# Altium schematic sheet ToolDoorController.SchDoc: Tool Armoury Slave
size A4; DrawnBy: Luke Hovington; Organization: HSBNE; DocumentNumber: 1; Revision: 1.3; SheetNumber: 1; SheetTotal: 1; ProjectName: Tool Armoury Slave
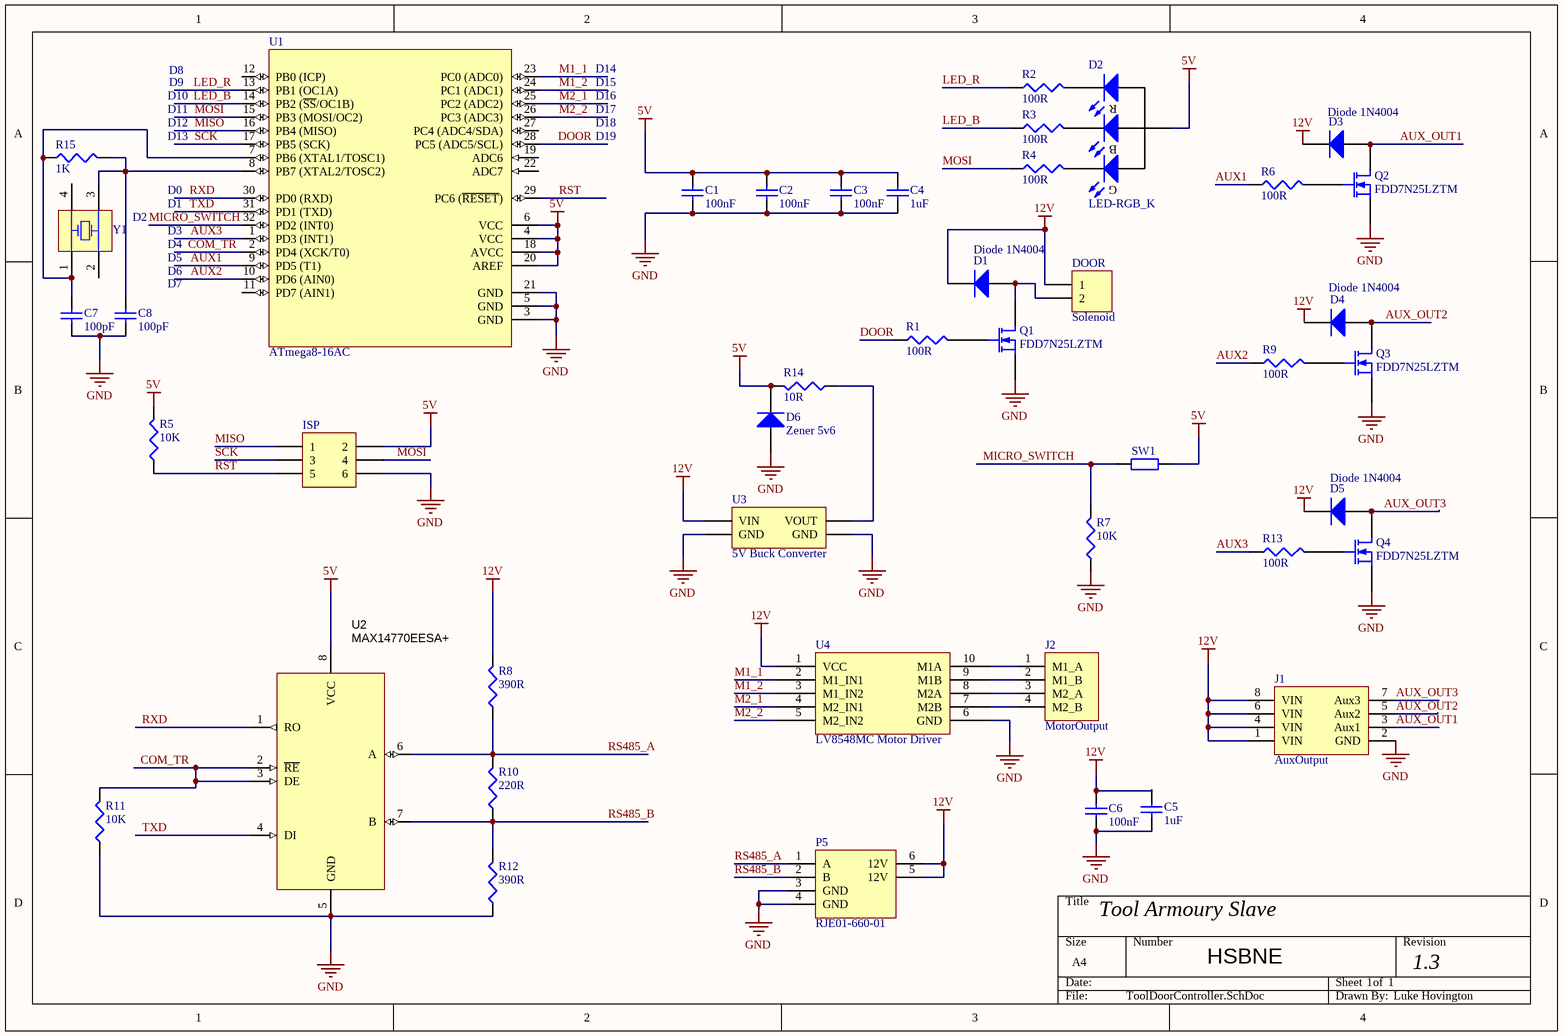
[diagram p0: ToolDoorController.SchDoc]

## Parts
C1  100nF  [C1206]
C2  100nF  [C1206]
C3  100nF  [C1206]
C4  1uF  [C1206]
C5  1uF  [C1206]
C6  100nF  [C1206]
C7  100pF  [C1206]
C8  100pF  [C1206]
D1  Diode 1N4004  [DO-41]
D2  LED-RGB_K  [RGB-CLVBAFKA]
D3  Diode 1N4004  [DO-41]  (no BOM)
D4  Diode 1N4004  [DO-41]  (no BOM)
D5  Diode 1N4004  [DO-41]  (no BOM)
D6  Zener 5v6  [DO-41]
DOOR  Solenoid  [JST-XH]
ISP  ISP  [HDR2X3]  (value not drawn)
J1  AuxOutput  [AUX-Out]
J2  MotorOutput  [Motor_Out]
P5  RJE01-660-01  [RJ11]
Q1  FDD7N25LZTM  [DPAC-3]
Q2  FDD7N25LZTM  [DPAC-3]  (no BOM)
Q3  FDD7N25LZTM  [DPAC-3]  (no BOM)
Q4  FDD7N25LZTM  [DPAC-3]  (no BOM)
R1  100R  [C1206]
R2  100R  [C1206]
R3  100R  [C1206]
R4  100R  [C1206]
R5  10K  [C1206]
R6  100R  [C1206]
R7  10K  [C1206]
R8  390R  [C1206]  (no BOM)
R9  100R  [C1206]
R10  220R  [C1206]  (no BOM)
R11  10K  [C1206]
R12  390R  [C1206]  (no BOM)
R13  100R  [C1206]
R14  10R  [C1206]
R15  1K  [C1206]
SW1  Switch  [ReedSwitch]  (value not drawn)
U1  ATmega8-16AC  [32A_N]
U2  MAX14770EESA+  [8S1_L]
U3  5V Buck Converter  [Buck_Module - upsidedown]
U4  LV8548MC Motor Driver  [10S1_M]
Y1  Crystal  [CRYSTAL_AXIAL]  (value not drawn)

## Nets
5V: C1.2 C2.2 C3.2 C4.2 D2.2(A) D6.2(K) ISP.2 R5.2 R14.2 SW1.2 U1.4(VCC) U1.6(VCC) U1.18(AVCC) U1.20(AREF) U2.8(VCC)
12V: C5.2 C6.2 D1.2(K) D3.2(K) D4.2(K) D5.2(K) DOOR.1 J1.1(VIN) J1.4(VIN) J1.6(VIN) J1.8(VIN) P5.5(12V) P5.6(12V) R8.2 U3.1(VIN) U4.1(VCC)
GND: C1.1 C2.1 C3.1 C4.1 C5.1 C6.1 C7.1 C8.1 D6.1(A) ISP.6 J1.2(GND) P5.3(GND) P5.4(GND) Q1.3(S) Q2.3(S) Q3.3(S) Q4.3(S) R7.1 R11.1 R12.1 U1.3(GND) U1.5(GND) U1.21(GND) U2.5(GND) U3.3(GND) U3.4(GND) U4.6(GND)
AUX1: R6.1 U1.9(PD5_(T1))
AUX2: R9.1 U1.10(PD6_(AIN0))
AUX3: R13.1 U1.1(PD3_(INT1))
AUX_OUT1: D3.1(A) J1.3(Aux1) Q2.1(D)
AUX_OUT2: D4.1(A) J1.5(Aux2) Q3.1(D)
AUX_OUT3: D5.1(A) J1.7(Aux3) Q4.1(D)
COM_TR: R11.2 U1.2(PD4_(XCK/T0)) U2.2(~{RE}) U2.3(DE)
DOOR: R1.1 U1.28(PC5_(ADC5/SCL))
LED_B: R3.1 U1.14(PB2_(~{SS}/OC1B))
LED_R: R2.1 U1.13(PB1_(OC1A))
M1_1: U1.23(PC0_(ADC0)) U4.2(M1_IN1)
M1_2: U1.24(PC1_(ADC1)) U4.3(M1_IN2)
M2_1: U1.25(PC2_(ADC2)) U4.4(M2_IN1)
M2_2: U1.26(PC3_(ADC3)) U4.5(M2_IN2)
MICRO_SWITCH: R7.2 SW1.1 U1.32(PD2_(INT0))
MISO: ISP.1 U1.16(PB4_(MISO))
MOSI: ISP.4 R4.1 U1.15(PB3_(MOSI/OC2))
RS485_A: P5.1(A) R8.1 R10.2 U2.6(A)
RS485_B: P5.2(B) R10.1 R12.2 U2.7(B)
RST: ISP.5 R5.1 U1.29(PC6_(~{RESET}))
RXD: U1.30(PD0_(RXD)) U2.1(RO)
SCK: ISP.3 U1.17(PB5_(SCK))
TXD: U1.31(PD1_(TXD)) U2.4(DI)
NetC7_2: C7.2 R15.1 U1.7(PB6_(XTAL1/TOSC1)) Y1.1(OSC1)
NetC8_2: C8.2 R15.2 U1.8(PB7_(XTAL2/TOSC2)) Y1.3(OSC2)
NetD1_1: D1.1(A) DOOR.2 Q1.1(D)
NetD2_1: D2.1(K-R) R2.2
NetD2_3: D2.3(K-B) R3.2
NetD2_4: D2.4(K-G) R4.2
NetJ2_1: J2.1(M1_A) U4.10(M1A)
NetJ2_2: J2.2(M1_B) U4.9(M1B)
NetJ2_3: J2.3(M2_A) U4.8(M2A)
NetJ2_4: J2.4(M2_B) U4.7(M2B)
NetQ1_2: Q1.2(G) R1.2
NetQ2_2: Q2.2(G) R6.2
NetQ3_2: Q3.2(G) R9.2
NetQ4_2: Q4.2(G) R13.2
NetR14_1: R14.1 U3.2(VOUT)

Not connected (* = marked no-connect by the designer): U1 11(PD7_(AIN1)) 12(PB0_(ICP)) 19(ADC6) 22(ADC7) 27(PC4_(ADC4/SDA)); Y1 2(OSC2) 4(OSC1)

## Notes on the sheet
- D10
- D11
- D8
- D9
- D14
- D15
- D16
- D17
- D12
- D13
- D18
- D19
- (near Y1) D2
- D0
- D1
- D3
- D4
- D5
- D6
- (near C8) D7
- (in symbol LED-RGB_K) R; B; G

## Library data of the parts
C1-C3 C6 = Cap 100nF: Capacitor (Semiconductor SIM Model); Published: 8-Jun-2000; LatestRevisionDate: 29-May-2009; LatestRevisionNote: IPC-7351 Footprint Added.; PackageReference: C1206; Publisher: Altium Limited; PackageDescription: Chip Capacitor; Value: 100nF; Supplier 1: Digi-Key; Supplier 2: Mouser; Supplier Part Number 1: 399-1249-1-ND; Supplier Part Number 2: 80-C1206C104K5R
C4 C5 = Cap 1uF: Capacitor (Semiconductor SIM Model); Published: 8-Jun-2000; LatestRevisionDate: 29-May-2009; LatestRevisionNote: IPC-7351 Footprint Added.; PackageReference: C1206; Publisher: Altium Limited; PackageDescription: Chip Capacitor; Value: 1uF; Supplier 1: Mouser; Supplier 2: Digi-Key; Supplier Part Number 1: 80-C1206C105K5R; Supplier Part Number 2: 399-8150-1-ND
C7 C8 = Cap 100nF: Capacitor (Semiconductor SIM Model); Value: 100nF; Published: 8-Jun-2000; LatestRevisionDate: 29-May-2009; LatestRevisionNote: IPC-7351 Footprint Added.; PackageReference: C1206; Publisher: Altium Limited; PackageDescription: Chip Capacitor; Supplier 1: Digi-Key; Supplier 2: Mouser; Supplier Part Number 1: 399-1249-1-ND; Supplier Part Number 2: 80-C1206C104K5R
D1 D3-D5 = Diode 1N4004: 1 Amp General Purpose Rectifier; Published: 8-Jun-2000; LatestRevisionDate: 17-Jul-2002; LatestRevisionNote: Re-released for DXP Platform.; DatasheetVersion: 1998; PackageVersion: Aug-1999; PackageReference: DO-41; Publisher: Altium Limited; PackageDescription: Diode, Axial; Body 5.2 x 2.7 mm (LxDia. max), Lead Dia. 0.86 mm (max); Code_JEDEC: DO-204-AL; ComponentLink1Description: Manufacturer Link; ComponentLink1URL: http://www.fairchildsemi.com/; ComponentLink2Description: Datasheet; ComponentLink2URL: http://www.fairchildsemi.com/ds/1N%2F1N4001.pdf; Supplier 1: Digi-Key; Supplier Part Number 1: 1N4004-TPMSCT-ND
D2 = LED-RGB_K: RED, GREEN, BLUE LED; Published: 8-Jun-2000; LatestRevisionDate: 17-Jul-2002; LatestRevisionNote: Re-released for DXP Platform.; PackageVersion: Feb-2002; PackageReference: 3.2X1.6X1.1; Publisher: Altium Limited; PackageDescription: SM LED; 2 Flat Leads; Supplier 1: Digi-Key; Supplier 2: Mouser; Supplier Part Number 1: CLVBA-FKA-CAEDH8BBB7A363CT-ND; Supplier Part Number 2: 941-VBAFKACAEDH8B7A3
D6 = Zener 1N5232BTR: 5v6 Zener; Published: 8-Jun-2000; LatestRevisionDate: 17-Jul-2002; LatestRevisionNote: Re-released for DXP Platform.; DatasheetVersion: 1998; PackageVersion: Aug-1999; PackageReference: DO-41; Publisher: Altium Limited; PackageDescription: Diode, Axial; Body 5.2 x 2.7 mm (LxDia. max), Lead Dia. 0.86 mm (max); Code_JEDEC: DO-204-AL; ComponentLink1Description: Manufacturer Link; ComponentLink1URL: http://www.fairchildsemi.com/; ComponentLink2Description: Datasheet; ComponentLink2URL: http://www.fairchildsemi.com/ds/1N%2F1N4001.pdf; Supplier 1: Digi-Key; Supplier 2: Mouser; Supplier Part Number 1: 1N5232BFSCT-ND; Supplier Part Number 2: 512-1N5232BTR
DOOR = Header 2 JST-XH: Header, 2-Pin; LatestRevisionDate: 17-Jul-2002; LatestRevisionNote: Re-released for DXP Platform.; Publisher: Altium Limited; Supplier 1: Digi-Key; Supplier Part Number 1: 455-2247-ND
ISP = Header 3X2: Header, 3-Pin, Dual row; LatestRevisionDate: 17-Jul-2002; LatestRevisionNote: Re-released for DXP Platform.; Publisher: Altium Limited; Supplier 1: Digi-Key; Supplier 2: Mouser; Supplier Part Number 1: 952-2121-ND; Supplier Part Number 2: 855-M20-9980346
J1 = AuxOut: LatestRevisionDate: 17-Jul-2002; LatestRevisionNote: Re-released for DXP Platform.; Publisher: Altium Limited
J2 = MotorOut: LatestRevisionDate: 17-Jul-2002; LatestRevisionNote: Re-released for DXP Platform.; Publisher: Altium Limited
P5 = RJ11: Supplier 1: Mouser; Supplier 2: Farnell; Supplier Part Number 1: 523-RJE01-660-01; Supplier Part Number 2: 2095366; Supplier 3: Digi-Key; Supplier Part Number 3: RJE0166001-ND
Q1-Q4 = MOSFET-N: N-Channel MOSFET; Published: 8-Jun-2000; LatestRevisionDate: 17-Jul-2002; LatestRevisionNote: Re-released for DXP Platform.; PackageVersion: 1995/1996; PackageReference: E3; Publisher: Altium Limited; PackageDescription: TO, Flat Index; 3 In-Line, Axial Leads; Body Dia. 4.6mm; Lead Dia. 0.5 mm (max); Supplier 1: Digi-Key; Supplier 2: Mouser; Supplier Part Number 1: FDD7N25LZTMCT-ND; Supplier Part Number 2: 512-FDD7N25LZTM
R1-R4 R6 R9 R13 = Resistor-100R: Resistor; Published: 8-Jun-2000; LatestRevisionDate: 29-May-2009; LatestRevisionNote: IPC-7351 Footprint Added.; PackageReference: J1-0603; Publisher: Altium Limited; PackageDescription: Chip Resistor; Value: 100R; Supplier 1: Digi-Key; Supplier Part Number 1: RMCF1206JT100RCT-ND
R5 R7 R11 = Resistor-10K: Resistor; Published: 8-Jun-2000; LatestRevisionDate: 29-May-2009; LatestRevisionNote: IPC-7351 Footprint Added.; PackageReference: J1-0603; Publisher: Altium Limited; PackageDescription: Chip Resistor; Value: 10K; Supplier 1: Digi-Key; Supplier 2: Mouser; Supplier Part Number 1: P10KECT-ND; Supplier Part Number 2: 71-CRCW1206-10K-E3
R8 R12 = Resistor-390R: Resistor; Published: 8-Jun-2000; LatestRevisionDate: 29-May-2009; LatestRevisionNote: IPC-7351 Footprint Added.; PackageReference: J1-0603; Publisher: Altium Limited; PackageDescription: Chip Resistor; Value: 390R; Supplier 1: Digi-Key; Supplier Part Number 1: RMCF1206JT390RCT-ND
R10 = Resistor-220R: Resistor; Published: 8-Jun-2000; LatestRevisionDate: 29-May-2009; LatestRevisionNote: IPC-7351 Footprint Added.; PackageReference: J1-0603; Publisher: Altium Limited; PackageDescription: Chip Resistor; Value: 220R; Supplier 1: Digi-Key; Supplier Part Number 1: RMCF1206JT220RCT-ND
R14 = Resistor-10R: Resistor; Published: 8-Jun-2000; LatestRevisionDate: 29-May-2009; LatestRevisionNote: IPC-7351 Footprint Added.; PackageReference: J1-0603; Publisher: Altium Limited; PackageDescription: Chip Resistor; Value: 10R; Supplier 1: Digi-Key; Supplier Part Number 1: P10.0FCT-ND; Supplier 2: Mouser; Supplier Part Number 2: 71-TNPW120610R0BEEA
R15 = Resistor-10K: Resistor; Value: 10K; Published: 8-Jun-2000; LatestRevisionDate: 29-May-2009; LatestRevisionNote: IPC-7351 Footprint Added.; PackageReference: J1-0603; Publisher: Altium Limited; PackageDescription: Chip Resistor; Supplier 1: Digi-Key; Supplier 2: Mouser; Supplier Part Number 1: P10KECT-ND; Supplier Part Number 2: 71-CRCW1206-10K-E3
SW1 = Switch: ReedSwitch; Published: 8-Jun-2000; LatestRevisionDate: 17-Jul-2002; LatestRevisionNote: Re-released for DXP Platform.; PackageReference: AXIAL-0.4; Publisher: Altium Limited; PackageDescription: Axial Device, Thru-Hole; 2 Leads; 0.4 in Pin Spacing
U1 = ATmega8-16AC: 8-Bit AVR Microcontroller with 8K Bytes of In-System Programmable Flash Memory; Published: 17-Sep-2003; LatestRevisionDate: 16-Oct-2006; LatestRevisionNote: IPC-7351 Footprint Added.; DatasheetVersion: 2486H-AVR-09/02; PackageVersion: revB, Oct-2001; PackageReference: 32A; Publisher: Altium Limited; PackageDescription: 32-Lead, 7x7x1.0 mm Body, 0.8mm Lead Pitch, Thin Profile Plastic Quad Flat Package (TQFP); Supplier 1: Digi-Key; Supplier Part Number 1: ATMEGA8-16AC-ND; Supplier 2: Mouser; Supplier Part Number 2: 556-ATMEGA8-16AC; Code_JEDEC: MS-026-ABA; ComponentLink1Description: Datasheet; ComponentLink1URL: http://www.atmel.com/dyn/resources/prod_documents/doc2486.pdf; ComponentLink2Description: Atmel.com Home; ComponentLink2URL: http://www.atmel.com
U2 = MAX14770EESA+: TXRX PROFIBUS RS-485 8-SOIC; MPN: MAX14770EESA+; Supplier 1: Mouser; Supplier 2: Digi-Key; Supplier Part Number 1: 700-MAX14770EESA+; Supplier Part Number 2: MAX14770EESA+-ND
U3 = 5V Buck: 5V Buck Converter Module; LatestRevisionDate: 17-Jul-2002; LatestRevisionNote: Re-released for DXP Platform.; Publisher: Altium Limited
U4 = LV8548MC: Forward/Reverse Motor Driver; Supplier 1: Digi-Key; Supplier 2: Mouser; Supplier 3: Farnell; Supplier Part Number 1: 869-1287-1-ND; Supplier Part Number 2: 863-LV8548MC-AH; Supplier Part Number 3: 2217011
Y1 = Crystal: Surface Mount Quartz Crystal; pin to pad: 3>2 4>1; Note: PCB layout complies with manufacturer's recommendation.; Published: 17-Jul-2002; DatasheetDocument: 28-Aug-2001; PackageDocument: 28-Aug-2001; PackageReference: 91SMX; Publisher: Altium Limited; ComponentLink1Description: Manufacturer Link; ComponentLink1URL: http://www.cmac.com/mt/; ComponentLink2Description: Datasheet; ComponentLink2URL: http://www.cmac.com/mt/databook/crystals/smd/90_91_smx.pdf